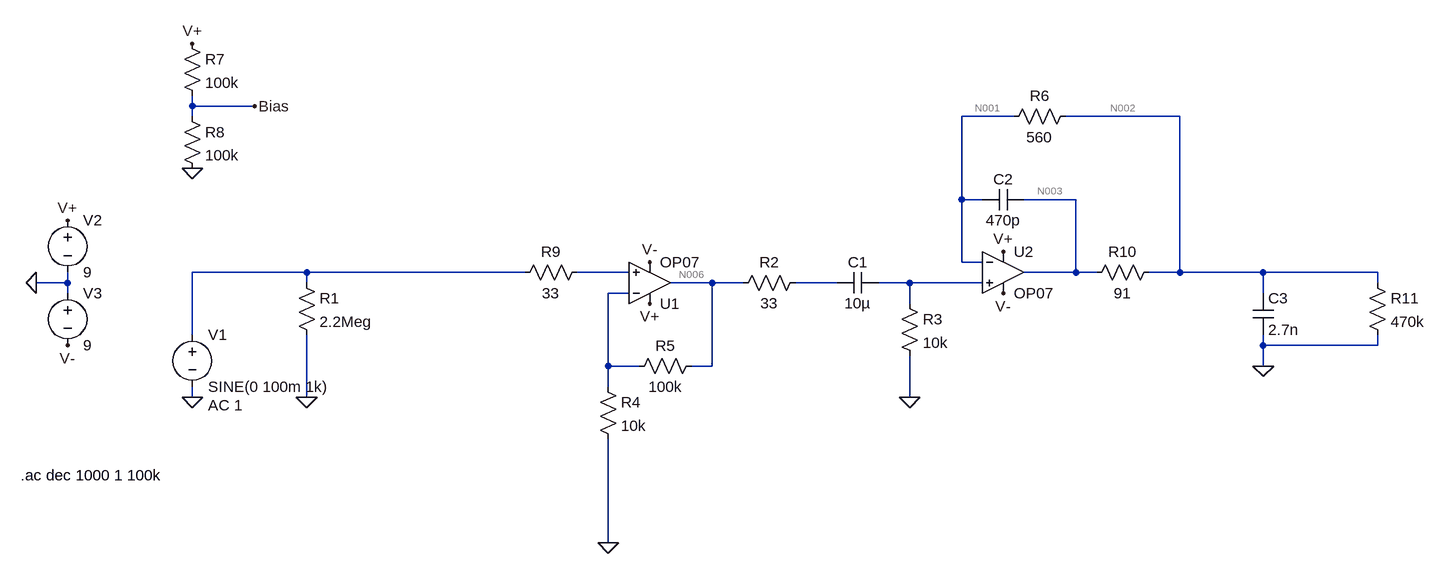
[diagram p0: schematic Input_Buffer.asc]
Input_Buffer.asc, the LTspice schematic file:
Version 4
SHEET 1 2048 680
WIRE 144 -192 144 -208
WIRE 240 -192 144 -192
WIRE 144 -176 144 -192
WIRE 1408 -176 1328 -176
WIRE 1664 -176 1488 -176
WIRE 1328 -48 1328 -176
WIRE 1360 -48 1328 -48
WIRE 1504 -48 1424 -48
WIRE 1328 48 1328 -48
WIRE 1360 48 1328 48
WIRE 320 64 144 64
WIRE 656 64 320 64
WIRE 816 64 736 64
WIRE 1504 64 1504 -48
WIRE 1504 64 1424 64
WIRE 1536 64 1504 64
WIRE 1664 64 1664 -176
WIRE 1664 64 1616 64
WIRE 1792 64 1664 64
WIRE 1968 64 1792 64
WIRE -48 80 -48 64
WIRE -48 80 -96 80
WIRE 320 80 320 64
WIRE 944 80 880 80
WIRE 992 80 944 80
WIRE 1136 80 1072 80
WIRE 1248 80 1200 80
WIRE 1360 80 1248 80
WIRE 1968 80 1968 64
WIRE -48 96 -48 80
WIRE 816 96 784 96
WIRE 1792 96 1792 64
WIRE 1248 112 1248 80
WIRE 144 160 144 64
WIRE 1792 176 1792 160
WIRE 1968 176 1968 160
WIRE 1968 176 1792 176
WIRE 784 208 784 96
WIRE 832 208 784 208
WIRE 944 208 944 80
WIRE 944 208 912 208
WIRE 1792 208 1792 176
WIRE 784 240 784 208
WIRE 144 256 144 240
WIRE 320 256 320 160
WIRE 1248 256 1248 192
WIRE 784 480 784 320
FLAG 144 256 0
FLAG 320 256 0
FLAG 848 112 V+
FLAG 848 48 V-
FLAG 784 480 0
FLAG -48 -16 V+
FLAG -48 176 V-
FLAG -96 80 0
FLAG 144 -96 0
FLAG 240 -192 Bias
FLAG 144 -288 V+
FLAG 1248 256 0
FLAG 1392 32 V+
FLAG 1392 96 V-
FLAG 1792 208 0
SYMBOL voltage 144 144 R0
WINDOW 123 24 124 Left 2
WINDOW 39 0 0 Left 0
SYMATTR Value2 AC 1
SYMATTR InstName V1
SYMATTR Value SINE(0 100m 1k)
SYMBOL res 304 64 R0
SYMATTR InstName R1
SYMATTR Value 2.2Meg
SYMBOL OpAmps\\OP07 848 144 M180
SYMATTR InstName U1
SYMBOL res 768 224 R0
SYMATTR InstName R4
SYMATTR Value 10k
SYMBOL res 928 192 R90
WINDOW 0 0 56 VBottom 2
WINDOW 3 32 56 VTop 2
SYMATTR InstName R5
SYMATTR Value 100k
SYMBOL voltage -48 -32 R0
WINDOW 123 0 0 Left 0
WINDOW 39 0 0 Left 0
SYMATTR InstName V2
SYMATTR Value 9
SYMBOL voltage -48 80 R0
WINDOW 123 0 0 Left 0
WINDOW 39 0 0 Left 0
SYMATTR InstName V3
SYMATTR Value 9
SYMBOL res 128 -304 R0
SYMATTR InstName R7
SYMATTR Value 100k
SYMBOL res 128 -192 R0
SYMATTR InstName R8
SYMATTR Value 100k
SYMBOL res 752 48 R90
WINDOW 0 0 56 VBottom 2
WINDOW 3 32 56 VTop 2
SYMATTR InstName R9
SYMATTR Value 33
SYMBOL res 1088 64 R90
WINDOW 0 0 56 VBottom 2
WINDOW 3 32 56 VTop 2
SYMATTR InstName R2
SYMATTR Value 33
SYMBOL cap 1200 64 R90
WINDOW 0 0 32 VBottom 2
WINDOW 3 32 32 VTop 2
SYMATTR InstName C1
SYMATTR Value 10µ
SYMBOL res 1232 96 R0
SYMATTR InstName R3
SYMATTR Value 10k
SYMBOL OpAmps\\OP07 1392 0 R0
SYMATTR InstName U2
SYMBOL cap 1424 -64 R90
WINDOW 0 0 32 VBottom 2
WINDOW 3 32 32 VTop 2
SYMATTR InstName C2
SYMATTR Value 470p
SYMBOL res 1504 -192 R90
WINDOW 0 0 56 VBottom 2
WINDOW 3 32 56 VTop 2
SYMATTR InstName R6
SYMATTR Value 560
SYMBOL res 1632 48 R90
WINDOW 0 0 56 VBottom 2
WINDOW 3 32 56 VTop 2
SYMATTR InstName R10
SYMATTR Value 91
SYMBOL res 1952 64 R0
SYMATTR InstName R11
SYMATTR Value 470k
SYMBOL cap 1776 96 R0
SYMATTR InstName C3
SYMATTR Value 2.7n
TEXT -120 376 Left 2 !.ac dec 1000 1 100k

The netlist it stands for:
* Input_Buffer.asc
V1 N004 0 SINE(0 100m 1k) AC 1
R1 N004 0 2.2Meg
XU1 N005 N009 V+ V- N006 LT1001  ; OP07, pins In+ In- V+ V- OUT
R4 N009 0 10k
R5 N006 N009 100k
V2 V+ 0 9
V3 0 V- 9
R7 V+ Bias 100k
R8 Bias 0 100k
R9 N005 N004 33
R2 N007 N006 33
C1 N008 N007 10µ
R3 N008 0 10k
XU2 N008 N001 V+ V- N003 LT1001  ; OP07, pins In+ In- V+ V- OUT
C2 N003 N001 470p
R6 N002 N001 560
R10 N002 N003 91
R11 N002 0 470k
C3 N002 0 2.7n
.ac dec 1000 1 100k
.lib LTC.lib
.backanno
.end

* Results of the author's LTspice run, read from the files saved beside the schematic
* Operating Point, zero values left out:
*   V(v+) = 9 V
*   V(v-) = -9 V
*   V(bias) = 4.5 V
*   I(R8) = 45 µA
*   I(R7) = 45 µA
*   I(V3) = -4.5 mA
*   I(V2) = -4.545 mA
*   Ix(u1:3) = 2.25 mA
*   Ix(u1:4) = -2.25 mA
*   Ix(u2:3) = 2.25 mA
*   Ix(u2:4) = -2.25 mA
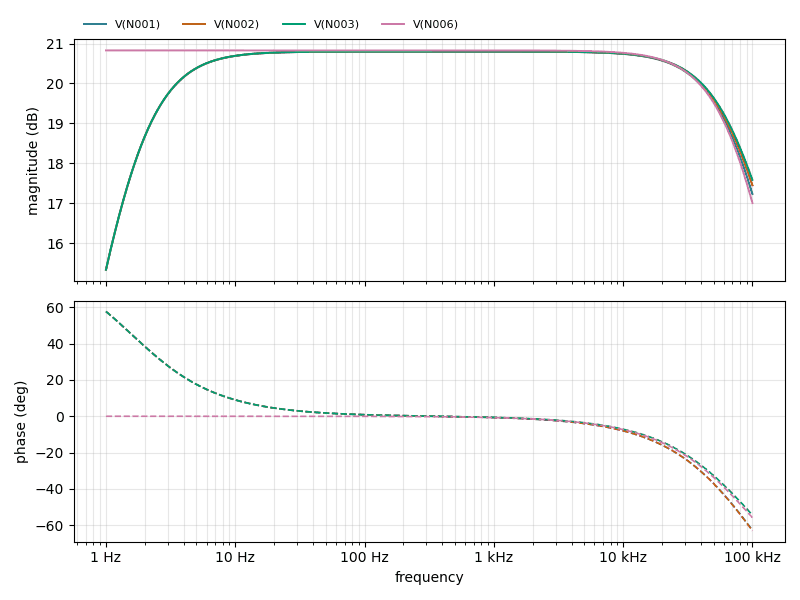
[diagram p1: AC Analysis of Input_Buffer.asc, plotted from the saved traces]
* AC Analysis, 1 run:
*   V(N001): 15.34 dB at 1 Hz, 17.23 dB at 100 kHz, peak 20.80 dB at 369.8 Hz, 3 dB below the peak at 1.586 Hz and 88.07 kHz
*   V(N002): 15.34 dB at 1 Hz, 17.45 dB at 100 kHz, peak 20.80 dB at 373.3 Hz, 3 dB below the peak at 1.586 Hz and 92 kHz
*   V(N003): 15.34 dB at 1 Hz, 17.59 dB at 100 kHz, peak 20.80 dB at 375.8 Hz, 3 dB below the peak at 1.586 Hz and 94.85 kHz
*   V(N006): 20.83 dB at 1 Hz, 17.01 dB at 100 kHz, peak 20.83 dB at 4.842 Hz, 3 dB below the peak at 84.27 kHz